# Altium schematic sheet RF.SchDoc: RF
size A4; Engineer: M.GUENI; Revision: R0; SheetNumber: 2; SheetTotal: 5
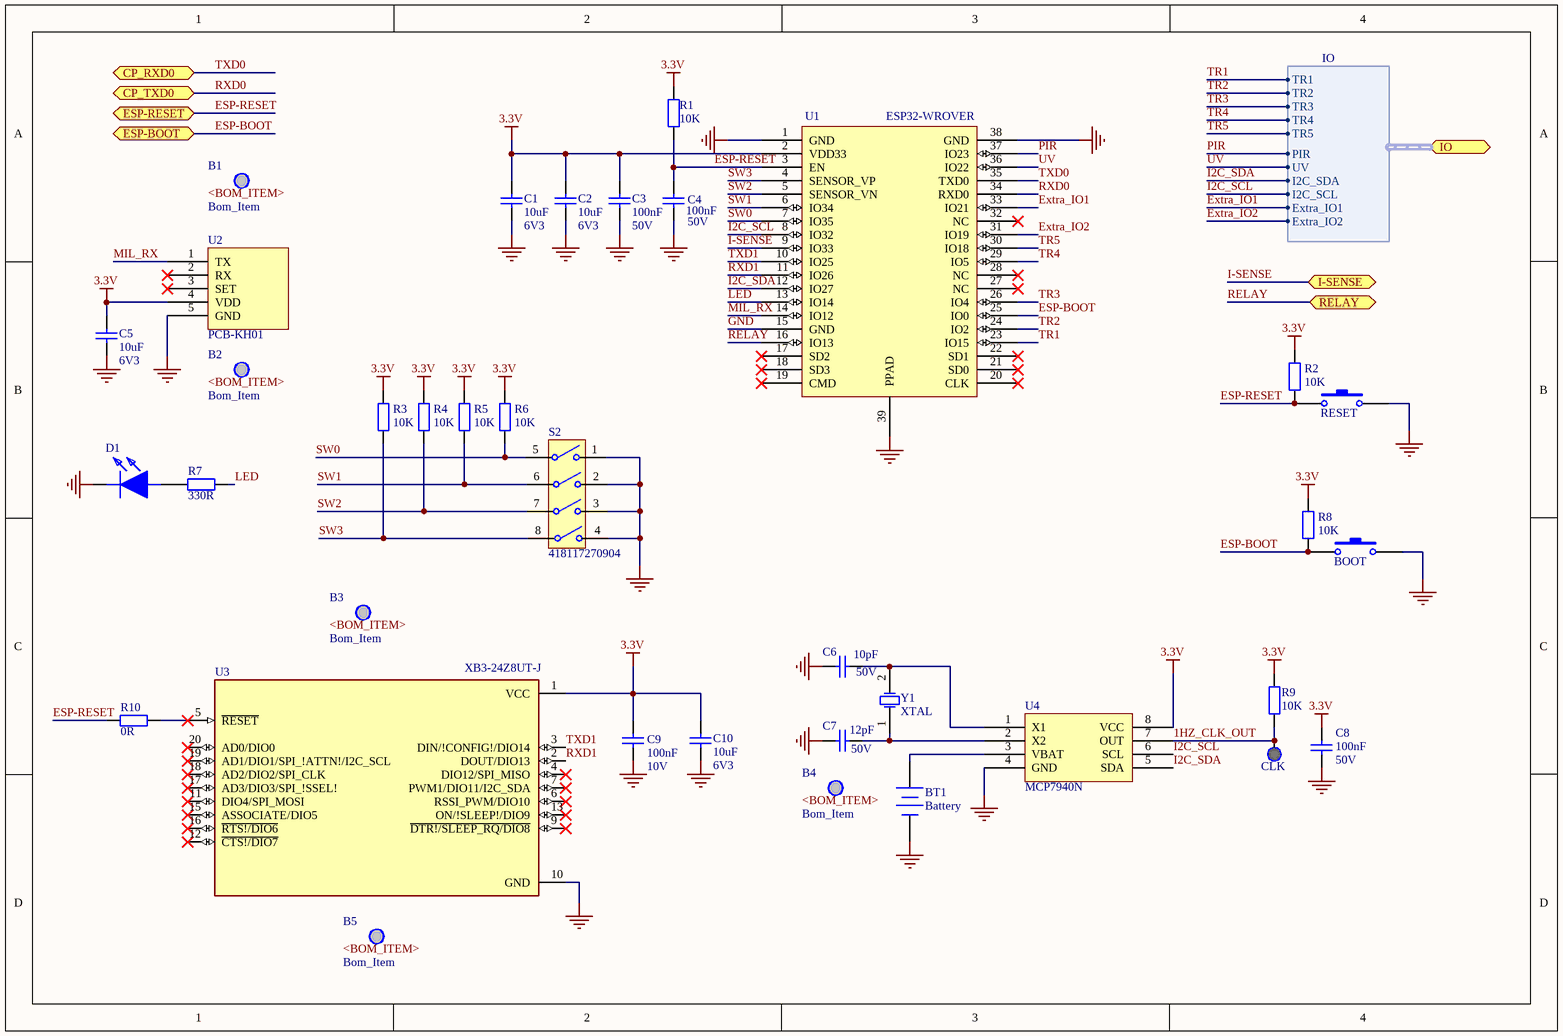
[diagram p0: RF.SchDoc]

## Parts
B1  Bom_Item  [_]  (mechanical)
B2  Bom_Item  [_]  (mechanical)
B3  Bom_Item  [_]  (mechanical)
B4  Bom_Item  [_]  (mechanical)
B5  Bom_Item  [_]  (mechanical)
BOOT  _  [FSM4]  (value not drawn)
BT1  Battery  [3050]
C1  Value 1: 10uF  Value 2: 6V3  [CAPC2012N]  (hidden comment: Capacitor)
C2  Value 1: 10uF  Value 2: 6V3  [CAPC2012N]  (hidden comment: Capacitor)
C3  Value 1: 100nF  Value 2: 50V  [CAPC1608N]  (hidden comment: Capacitor)
C4  Value 1: 100nF  Value 2: 50V  [CAPC1608N]  (hidden comment: Capacitor)
C5  Value 1: 10uF  Value 2: 6V3  [CAPC2012N]  (hidden comment: Capacitor)
C6  Value 1: 10pF  Value 2: 50V  [CAPC1608N]  (hidden comment: Capacitor)
C7  Value 1: 12pF  Value 2: 50V  [CAPC1608N]  (hidden comment: Capacitor)
C8  Value 1: 100nF  Value 2: 50V  [CAPC1608N]  (hidden comment: Capacitor)
C9  Value 1: 100nF  Value 2: 10V  [CAPC1608N]  (hidden comment: Capacitor)
C10  Value 1: 10uF  Value 2: 6V3  [CAPC2012N]  (hidden comment: Capacitor)
CLK  Test Point  [TP]  (value not drawn)  (no BOM)
D1  150080BS75000  [LEDC2012X80N1]  (value not drawn)
R1  Value 1: 10K  [RESC1608N]  (hidden comment: Resistor)
R2  Value 1: 10K  [RESC1608N]  (hidden comment: Resistor)
R3  Value 1: 10K  [RESC1608N]  (hidden comment: Resistor)
R4  Value 1: 10K  [RESC1608N]  (hidden comment: Resistor)
R5  Value 1: 10K  [RESC1608N]  (hidden comment: Resistor)
R6  Value 1: 10K  [RESC1608N]  (hidden comment: Resistor)
R7  Value 1: 330R  [RESC1608N]  (hidden comment: Resistor)
R8  Value 1: 10K  [RESC1608N]  (hidden comment: Resistor)
R9  Value 1: 10K  [RESC1608N]  (hidden comment: Resistor)
R10  Value 1: 0R  [RESC1608N]  (hidden comment: Resistor)
RESET  _  [FSM4]  (value not drawn)
S2  418117270904  [418117270904]
U1  ESP32-WROVER  [ESP32-WROVER]
U2  PCB-KH01  [MILIGHT_RF_MODULE]
U3  XB3-24Z8UT-J  [XB3-24Z8UT-J]
U4  MCP7940N  [DFN-8]
Y1  XTAL  [ECX-31B]

## Ports
CP_RXD0 (bidir), CP_TXD0 (bidir), ESP-BOOT (bidir), ESP-RESET (bidir), I-SENSE (bidir), IO (bidir, harness IO), RELAY (bidir)

## Harnesses
IO: TR1, TR2, TR3, TR4, TR5, PIR, UV, I2C_SDA, I2C_SCL, Extra_IO1, Extra_IO2

## Nets
3.3V: C1.1 C2.2 C3.2 C5.1 C8.2 C9.2 C10.2 R1.1 R2.2 R3.2 R4.2 R5.2 R6.2 R8.2 R9.2 U1.2(VDD33) U2.4(VDD) U3.1(VCC) U4.8(VCC)
GND: BOOT.2 BT1.2(-) C1.2 C2.1 C3.1 C4.1 C5.2 C6.1 C7.1 C8.1 C9.1 C10.1 D1.1(K) RESET.2 S2.1 S2.2 S2.3 S2.4 U1.1(GND) U1.15(GND) U1.38(GND) U1.39(PPAD) U2.5(GND) U3.10(GND) U4.4(GND)
1HZ_CLK_OUT: CLK.1 R9.1 U4.7(OUT)
ESP-BOOT: BOOT.1 R8.1 U1.25(IO0) ; port ESP-BOOT
ESP-RESET: C4.2 R1.2 R2.1 R10.2 RESET.1 U1.3(EN) ; port ESP-RESET
Extra_IO1: U1.33(IO21) ; port IO.Extra_IO1
Extra_IO2: U1.31(IO19) ; port IO.Extra_IO2
I2C_SCL: U1.8(IO32) U4.6(SCL) ; port IO.I2C_SCL
I2C_SDA: U1.12(IO27) U4.5(SDA) ; port IO.I2C_SDA
I-SENSE: U1.9(IO33) ; port I-SENSE
LED: R7.1 U1.13(IO14)
MIL_RX: U1.14(IO12) U2.1(TX)
PIR: U1.37(IO23) ; port IO.PIR
RELAY: U1.16(IO13) ; port RELAY
RXD0: U1.34(RXD0) ; port CP_TXD0
RXD1: U1.11(IO26) U3.2(DOUT/DIO13)
SW0: R6.1 S2.5 U1.7(IO35)
SW1: R5.1 S2.6 U1.6(IO34)
SW2: R4.1 S2.7 U1.5(SENSOR_VN)
SW3: R3.1 S2.8 U1.4(SENSOR_VP)
TR1: U1.23(IO15) ; port IO.TR1
TR2: U1.24(IO2) ; port IO.TR2
TR3: U1.26(IO4) ; port IO.TR3
TR4: U1.29(IO5) ; port IO.TR4
TR5: U1.30(IO18) ; port IO.TR5
TXD0: U1.35(TXD0) ; port CP_RXD0
TXD1: U1.10(IO25) U3.3(DIN/!CONFIG!/DIO14)
UV: U1.36(IO22) ; port IO.UV
NetBT1_1: BT1.1(+) U4.3(VBAT)
NetC6_2: C6.2 U4.1(X1) Y1.2(OSC2)
NetC7_2: C7.2 U4.2(X2) Y1.1(OSC1)
NetD1_2: D1.2(A) R7.2
NetR10_1: R10.1 U3.5(~{RESET})

Not connected (* = marked no-connect by the designer): U1 17(SD2)* 18(SD3)* 19(CMD)* 20(CLK)* 21(SD0)* 22(SD1)* 27(NC)* 28(NC)* 32(NC)*; U2 2(RX)* 3(SET)*; U3 4(DIO12/SPI_MISO)* 6(RSSI_PWM/DIO10)* 7(PWM1/DIO11/I2C_SDA)* 9(~{DTR!/SLEEP_RQ/DIO8})* 11(DIO4/SPI_MOSI)* 12(~{CTS!/DIO7})* 13(ON/!SLEEP!/DIO9)* 15(ASSOCIATE/DIO5)* 16(~{RTS!/DIO6})* 17(AD3/DIO3/SPI_!SSEL!)* 18(AD2/DIO2/SPI_CLK)* 19(AD1/DIO1/SPI_!ATTN!/I2C_SCL)* 20(AD0/DIO0)*

## Notes on the sheet
- Title:
- Micro Device Tunisie
- Size:
- Date:
- File:
- A4
- Engineer :
- Revision:
- Sheet
- of
- Cyber Parc  Hammam Sousse
- Avenue Charles De Gaulle
- 4011, Hammam-Sousse, Tunisie
- contact@mdtunisie.com
- (in symbol MIS-000000001) <BOM_ITEM>
- (in symbol MIS-000000019) <BOM_ITEM>
- (in symbol MIS-000000023) <BOM_ITEM>

## Library data of the parts
B1 B2 = MIS-000000019: MAN: TE CONNECTIVITY; MANREF: 215298-5; DES: Embase PCB, Carte-à-carte, 2.54 mm, 1 Rangée(s), 5 Contact(s), Montage traversant, AMPMODU Series; Value 1: 2.54 mm; SUP: Farnell; SUPREF: 2971171; Part Number: MIS-000000019; Value 2: _; TOL: _; FTP: _; NOTE: _
B3 B5 = MIS-000000001: MAN: TE CONNECTIVITY / Ajouter au comparateur / L'image a des fins d'illustration uniquement. Veuillez lire la description du produit. / TE CONNECTIVITY / Fabricant :; MANREF: 1-2314878-0; DES: 1-2314878-0 -  Connecteur carte-à-carte, 2 mm, 10 Contact(s), Embase, AMPMODU Series, Traversant, 1 Rangée(s); Value 1: 2mm; Value 2: 10pts; SUP: Farnell; SUPREF: 3289695; Part Number: MIS-000000001; TOL: _; FTP: _; NOTE: _
B4 = MIS-000000023: MAN: RENATA; MANREF: CR1025; DES: Batterie, Pile bouton, Cellule simple, 3 V, 1025, Lithium-dioxide de manganèse, 30 mAh; Value 1: 3V; Value 2: 30mAh; SUP: Farnell; SUPREF: 4199066; Part Number: MIS-000000023; TOL: _; FTP: _; NOTE: _
BOOT RESET = MIS-000000020: Part Number: MIS-000000020; MAN: _; MANREF: _; DES: _; Value 1: _; Value 2: _; TOL: _; FTP: _; SUP: _; SUPREF: _; NOTE: _
BT1 = MIS-000000022: Multicell Battery; MAN: Keystone Electronics; DES: Contacts de piles 10MM SM COIN CELL CLIP; Value 1: _; SUP: Mouser; SUPREF: 534-3050; Part Number: MIS-000000022; MANREF: 3050; Value 2: _; TOL: _; FTP: _; NOTE: _
C1 C2 C5 C10 = CAP-000000001: MAN: MULTICOMP; MANREF: MCTT21X106M6R3CT; DES: MCTT21X106M6R3CT -  Condensateur céramique multicouche CMS, 10 µF, 6.3 V, 0805 [2012 Metric], ± 20%, X5R, Série MCTT; TOL: 20%; FTP: 0805; SUP: Farnell; SUPREF: 1759476; NOTE: _; Part Number: CAP-000000001
C3 C4 C8 = CAP-000000002: MAN: VISHAY; MANREF: VJ0603V104ZXAPW1BC; DES: VJ0603V104ZXAPW1BC -  Condensateur céramique multicouche CMS, 0.1 µF, 50 V, 0603 [1608 Metric], +80%, -20%, Y5V; TOL: +80% -20%; FTP: 0603; SUP: Farnell; SUPREF: 2896408; NOTE: _; Part Number: CAP-000000002
C6 = CAP-000000014: MAN: MULTICOMP; MANREF: MC0603N100J500CT; DES: MULTICOMP  MC0603N100J500CT  CONDENSATEUR MLCC C0G/NP0 10PF 50V 0603; TOL: 5%; FTP: 0603; SUP: Farnell; SUPREF: 2320799; NOTE: _; Part Number: CAP-000000014
C7 = CAP-000000015: MAN: MULTICOMP; MANREF: MC0603N120J500CT; DES: MULTICOMP 	MC0603N120J500CT  Condensateur céramique multicouche CMS, Série MC, 12 pF, ± 5%, C0G / NP0, 50 V, 0603 [1608 Metric]; TOL: 5%; FTP: 0603; SUP: Farnell; SUPREF: 1759054; NOTE: _; Part Number: CAP-000000015
C9 = CAP-000000005: MAN: KEMET; MANREF: C0603X104K8RACTU; DES: C0603X104K8RACTU -  Condensateur céramique multicouche CMS, 0.1 µF, 10 V, 0603 [1608 Metric], ± 10%, X7R; TOL: 10%; FTP: 0603; SUP: Farnell; SUPREF: 2904937; NOTE: _; Part Number: CAP-000000005
CLK = MIS-000000003: MAN: _; Part Number: MIS-000000003; MANREF: _; DES: _; Value 1: _; Value 2: _; TOL: _; FTP: _; SUP: _; SUPREF: _; NOTE: _
D1 = LED-000000002: MAN: Wurth Elektronik; DES: Standard LEDs - SMD WL-SMCW SMDMono TpVw Waterclr 0805 Blue; Value 1: 20 mA; Value 2: _; SUP: Mouser; SUPREF: 710-150080BS75000; Part Number: LED-000000002; MANREF: 150080BS75000; TOL: _; FTP: _; NOTE: _
R1-R6 R8 R9 = RES-000000001: MAN: YAGEO; MANREF: RC0603FR-0710KL; DES: YAGEO (PHYCOMP)  RC0603FR-0710KL  RESISTANCE COUCHE EPAISSE 10K 0.1W 1%; Value 2: 0.1W; TOL: 1%; FTP: 0603; SUP: Farnell; SUPREF: 9238603; NOTE: _; Part Number: RES-000000001
R7 = RES-000000080: MAN: MULTICOMP; MANREF: MCMR06X331 JTL; DES: MCMR06X331 JTL -  Résistance à puce CMS, Céramique, 330 ohm, Série MCMR, 75 V, Couche épaisse, 0603 [1608 Metric]; Value 2: 0.1W; TOL: 1%; FTP: 0603; SUP: Farnell; SUPREF: 2073475; NOTE: _; Part Number: RES-000000080
R10 = RES-000000103: MAN: Vishay / Beyschlag; MANREF: MCT06030Z0000ZP500; DES: Thin Film Resistors - SMD Zero ohm Jumper; Value 2: 0.125W; TOL: _; FTP: 0603; SUP: Mouser; SUPREF: 594-MCT06030Z0000ZP5; Part Number: RES-000000103; NOTE: _
S2 = SWC-000000004: MAN: Wurth Elektronik; DES: Commutateurs DIL/Commutateurs SIL WS-DITV DIP 4p THT 2.54mm Hrztl Box; Value 1: _; SUP: Mouser; SUPREF: 710-418117270904; NOTE: In Stock; Part Number: SWC-000000004; MANREF: 418117270904; Value 2: _; TOL: _; FTP: _
U1 = RFC-000000001: MAN: Espressif Systems; DES: Modules WiFi / 802.11 SMD Module, ESP32-D0WDQ6, 32Mbits PSRAM, 32Mbits SPI flash, PCB Antenna; Value 1: _; SUP: ASTONE TECHNOLOGY; Part Number: RFC-000000001; MANREF: ESP32-WROVER; Value 2: _; TOL: _; FTP: _; SUPREF: ESP32-WROVER; NOTE: _
U2 = RFC-000000003: MAN: Milight; DES: RF Module; Value 1: _; SUP: Deliled; Part Number: RFC-000000003; MANREF: PCB-KH01; Value 2: _; TOL: _; FTP: _; SUPREF: PCB-KH01; NOTE: _
U3 = RFC-000000002: MAN: DIGI; DES: Zigbee Modules (802.15.4) XBee3,2.4 Ghz ZB 3.0, U.FL Ant, TH MT; Value 1: _; SUP: Mouser; SUPREF: 888-XB3-24Z8UT; Part Number: RFC-000000002; MANREF: XB3-24Z8UT-J; Value 2: _; TOL: _; FTP: _; NOTE: _
U4 = GIC-000000001: 64 x 8, Serial, I2C Real-Time Clock; MAN: Microchip Technology; MANREF: MCP7940NT-I/MNY; DES: Horloge en temps réel I2C GP RTCC 64B SRAM; Value 1: _; SUP: Mouser; SUPREF: 579-MCP7940NT-I/MNY; Part Number: GIC-000000001; Value 2: _; TOL: _; FTP: DFN-8; NOTE: _
Y1 = MIS-000000021: Crystal Oscillator; MAN: ECS; MANREF: ECS-.327-6-34B-TR; DES: Quartz 32.768kHz 6pF 20ppm -40C +85C; Value 1: 32.768KHZ; Value 2: 6pF; TOL: _; SUP: Mouser; SUPREF: 520-.327-6-34BT; Part Number: MIS-000000021; FTP: _; NOTE: _